# EAGLE design ramanPi_imagingBoard_ccdBoard (EAGLE 6.2)
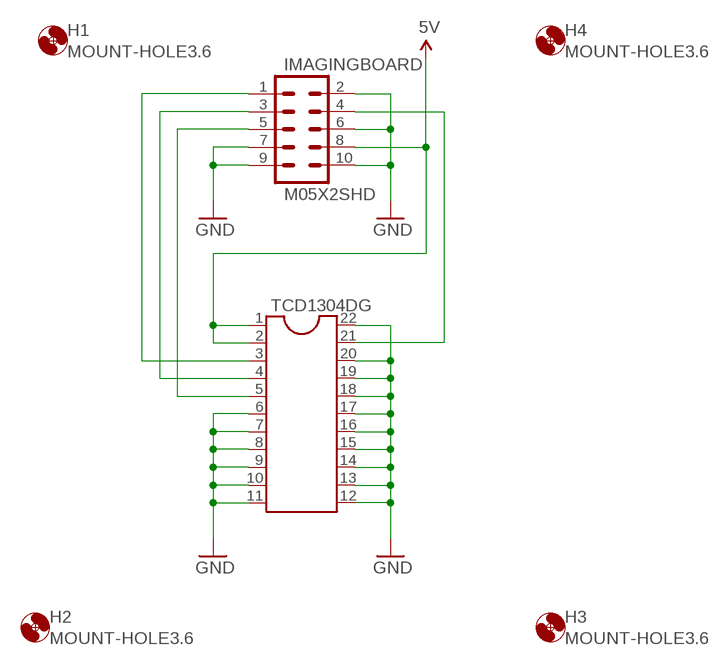
[diagram p0: schematic, sheet 1]

## Parts
H1  MOUNT-HOLE3.6  [3,6]
H2  MOUNT-HOLE3.6  [3,6]
H3  MOUNT-HOLE3.6  [3,6]
H4  MOUNT-HOLE3.6  [3,6]
IMAGINGBOARD  M05X2SHD  [2X5-SHROUDED]
TCD1304DG  DIL22-4  [DIL22-4]

## Nets
5V: IMAGINGBOARD.8 TCD1304DG.1 TCD1304DG.2
GND: IMAGINGBOARD.2 IMAGINGBOARD.6 IMAGINGBOARD.7 IMAGINGBOARD.9 IMAGINGBOARD.10 TCD1304DG.6 TCD1304DG.7 TCD1304DG.8 TCD1304DG.9 TCD1304DG.10 TCD1304DG.11 TCD1304DG.12 TCD1304DG.13 TCD1304DG.14 TCD1304DG.15 TCD1304DG.16 TCD1304DG.17 TCD1304DG.18 TCD1304DG.19 TCD1304DG.20 TCD1304DG.22
N$1: IMAGINGBOARD.1 TCD1304DG.3
N$2: IMAGINGBOARD.3 TCD1304DG.4
N$3: IMAGINGBOARD.5 TCD1304DG.5
N$4: IMAGINGBOARD.4 TCD1304DG.21

## Library data of the parts
H1-H4 = holes:MOUNT-HOLE: MOUNTING HOLE with drill center marker
IMAGINGBOARD = SparkFun-Connectors:M05X2: Header 5x2 Standard 10-pin dual row 0.1" header. Commonly used with AVR-ISP. Use with Spark Fun Electronics SKU: PRT-00778
TCD1304DG = ic-package:DIL22: Dual In Line / Socket

## Board
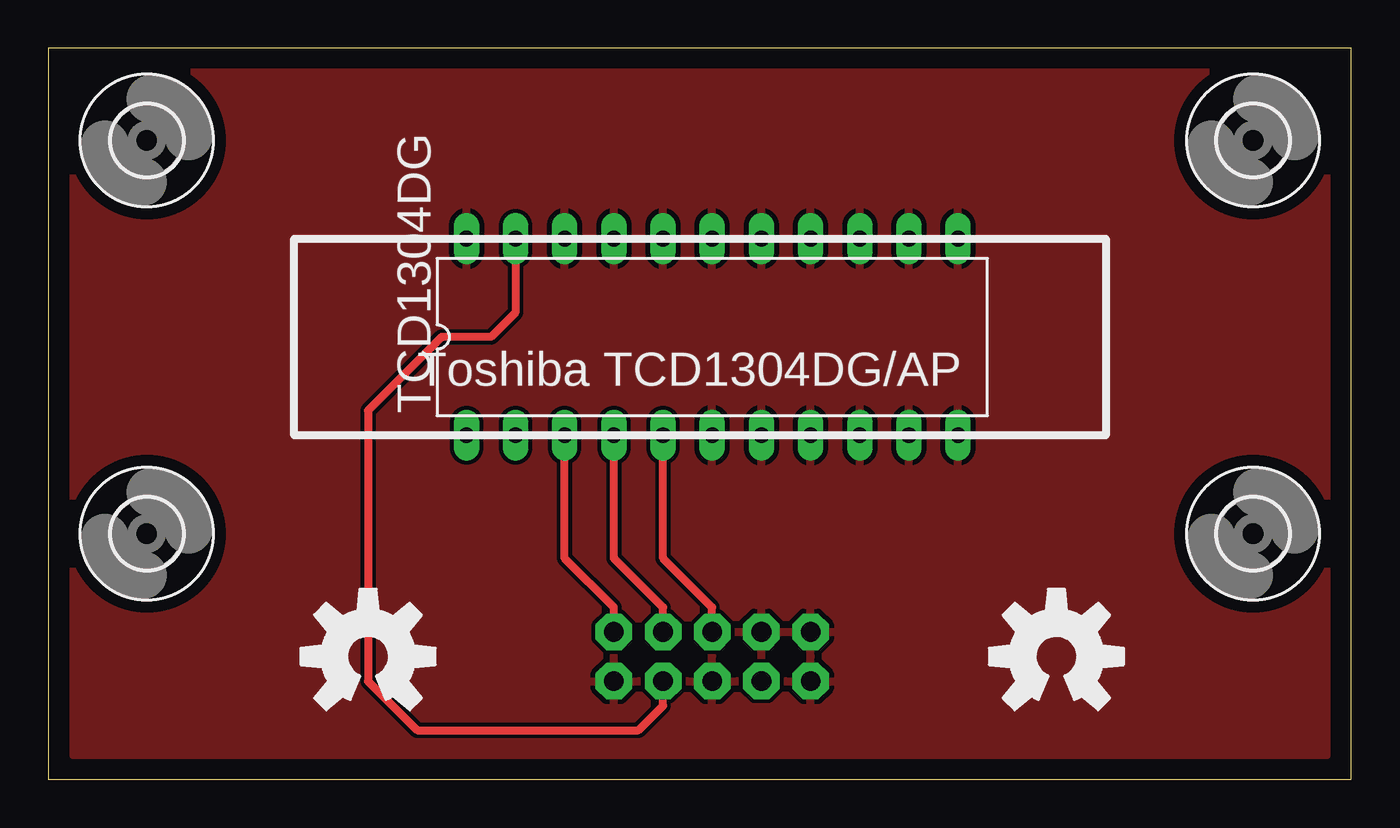
[diagram p1: board, top side]
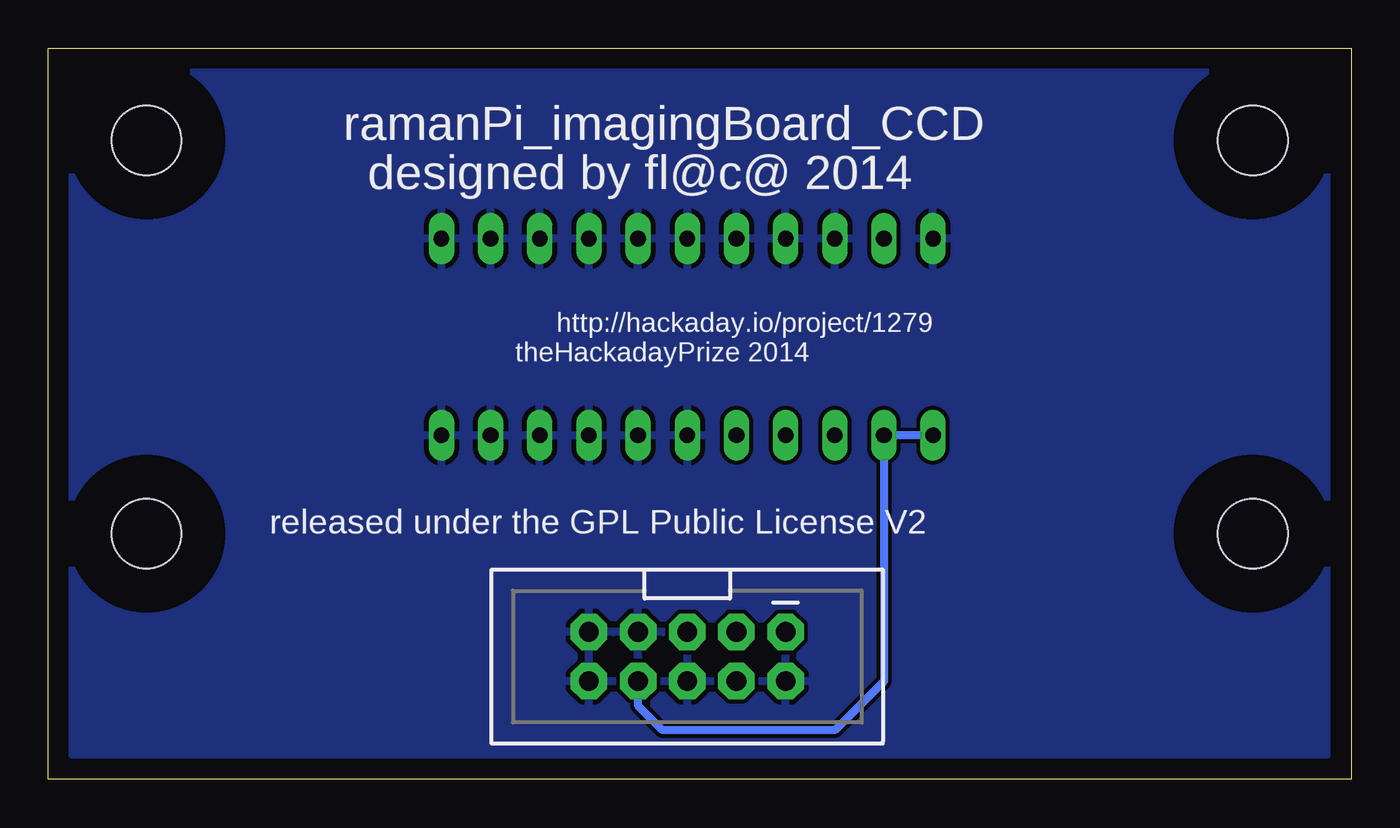
[diagram p2: board, bottom side, seen from below]

Size 67.29 x 37.77 mm. Coordinates in mm from the lower left corner, seen from the top.
Outline: 0,0 67.29,0 67.29,37.77 0,37.77 0,0
Copper layers (1*16): Top 0.035mm / dielectric 1.5mm / Bottom 0.035mm
Design rules: minimum track width 10mil, minimum drill 24mil, track to track 8mil, track to pad 8mil, pad to pad 8mil, via to via 8mil, smd to smd 8mil, copper to edge 40mil, drill to drill 8mil, minimum pad ring 10mil, minimum via ring 8mil, stop-mask expansion 4mil, vias tented up to drill 0mil, thermal gap 10mil

### Footprints (pad centres in the part's own frame; a part is rotated, then mirrored left to right if it is on the bottom)
3,6 = hole 3.6: 0,0
2X5-SHROUDED = drill 1.016 pad 1.88 octagon: 1 -1.27,5.08; 2 1.27,5.08; 3 -1.27,2.54; 4 1.27,2.54; 5 -1.27,0; 6 1.27,0; 7 -1.27,-2.54; 8 1.27,-2.54; 9 -1.27,-5.08; 10 1.27,-5.08
DIL22-4 = drill 0.813 long: 1 -12.7,-5.08; 2 -10.16,-5.08; 3 -7.62,-5.08; 4 -5.08,-5.08; 5 -2.54,-5.08; 6 0,-5.08; 7 2.54,-5.08; 8 5.08,-5.08; 9 7.62,-5.08; 10 10.16,-5.08; 11 12.7,-5.08; 12 12.7,5.08; 13 10.16,5.08; 14 7.62,5.08; 15 5.08,5.08; 16 2.54,5.08; 17 0,5.08; 18 -2.54,5.08; 19 -5.08,5.08; 20 -7.62,5.08; 21 -10.16,5.08; 22 -12.7,5.08

### Placement (x,y rotation side)
H1  5.08,33.02 0 top
H2  5.08,12.7 0 top
H3  62.23,12.7 0 top
H4  62.23,33.02 0 top
IMAGINGBOARD  34.29,6.35 270 bottom
TCD1304DG  34.29,22.86 0 top
U$1  [OSHW-LOGO-L]  52.07,6.35 0 top
U$2  [OSHW-LOGO-L]  16.51,6.35 0 top

### Tracks (layer width: path | path; a pad name or v marks a point on that pad's centre or on a via)
5V
  Bottom 0.406: IMAGINGBOARD.8 36.83,3.81 35.56,2.54 26.67,2.54 24.13,5.08 TCD1304DG.2 TCD1304DG.1
GND
  pour Top: 1.27,36.83 1.27,1.27 66.04,1.27 66.04,36.83
  pour Bottom: 1.27,36.83 1.27,1.27 66.04,1.27 66.04,36.83
N$1
  Top 0.406: IMAGINGBOARD.1 29.21,8.89 26.67,11.43 TCD1304DG.3
N$2
  Top 0.406: IMAGINGBOARD.3 31.75,8.89 29.21,11.43 TCD1304DG.4
N$3
  Top 0.406: IMAGINGBOARD.5 34.29,8.89 31.75,11.43 TCD1304DG.5
N$4
  Top 0.406: TCD1304DG.21 24.13,24.13 22.86,22.86 20.32,22.86 16.51,19.05 16.51,5.08 19.05,2.54 30.48,2.54 31.75,3.81 IMAGINGBOARD.4

### Text on the board
tPlace: Toshiba TCD1304DG/AP
bPlace: ramanPi_imagingBoard_CCD | designed by fl@c@ 2014 | http://hackaday.io/project/1279 | theHackadayPrize 2014 | released under the GPL Public License V2